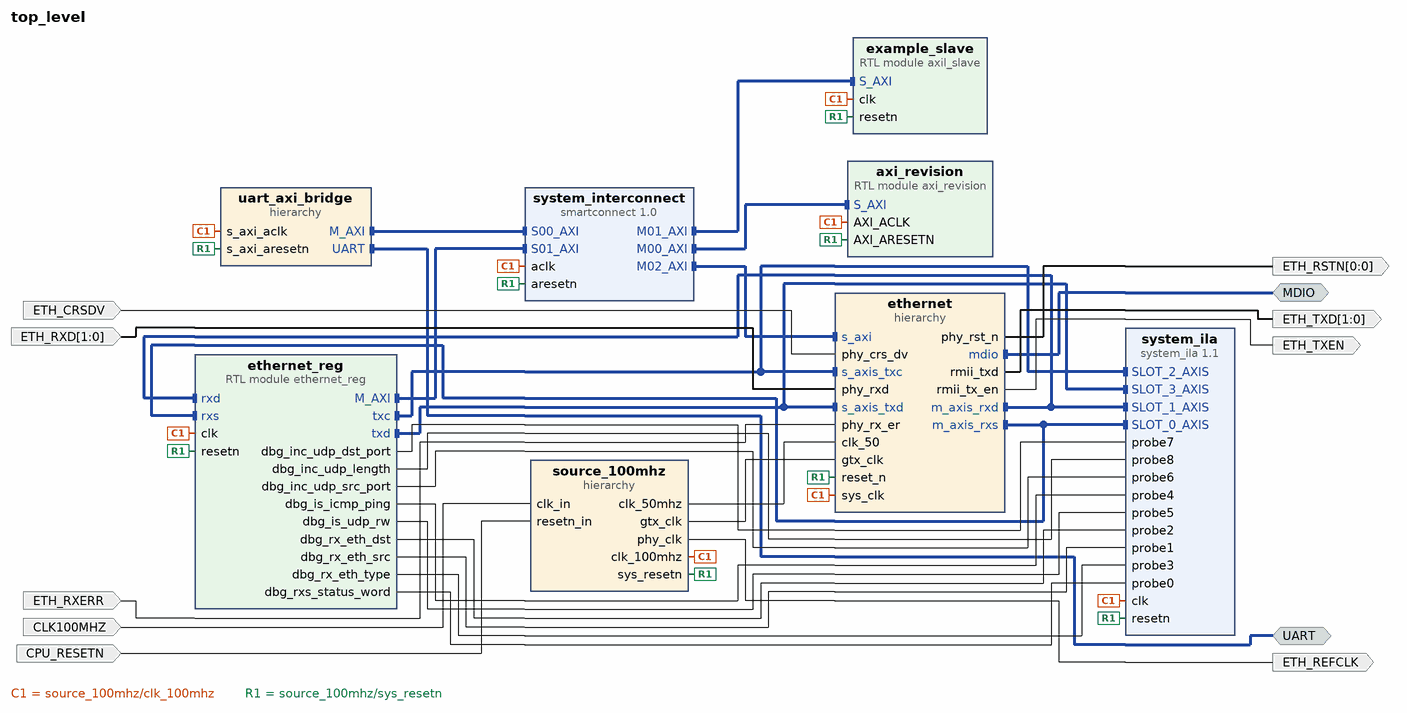
[diagram p0: block diagram of the top level]
# Vivado block design top_level, xc7a100tcsg324-1, Vivado 2024.2
create_bd_design top_level

create_bd_intf_port -mode Master -vlnv xilinx.com:interface:uart_rtl:1.0 UART
create_bd_intf_port -mode Master -vlnv xilinx.com:interface:mdio_rtl:1.0 MDIO
create_bd_port -dir I -type clk CLK100MHZ
create_bd_port -dir I -type rst CPU_RESETN
create_bd_port -dir I ETH_CRSDV
create_bd_port -dir O -from 1 -to 0 ETH_TXD
create_bd_port -dir O ETH_TXEN
create_bd_port -dir I -from 1 -to 0 ETH_RXD
create_bd_port -dir I ETH_RXERR
create_bd_port -dir O -from 0 -to 0 ETH_RSTN
create_bd_port -dir O -type clk ETH_REFCLK

create_bd_cell -type hier source_100mhz
create_bd_cell -type hier uart_axi_bridge
create_bd_cell -type ip -vlnv xilinx.com:ip:smartconnect:1.0 system_interconnect
set_property -dict {CONFIG.NUM_MI 3 CONFIG.NUM_SI 2} [get_bd_cells system_interconnect]
create_bd_cell -type module -reference axi_revision axi_revision
create_bd_cell -type module -reference axil_slave example_slave
create_bd_cell -type hier ethernet
create_bd_cell -type ip -vlnv xilinx.com:ip:system_ila:1.1 system_ila
set_property -dict [list \
  CONFIG.C_MON_TYPE MIX \
  CONFIG.C_NUM_MONITOR_SLOTS 4 \
  CONFIG.C_NUM_OF_PROBES 16 \
  CONFIG.C_SLOT 3 \
  CONFIG.C_SLOT_0_INTF_TYPE xilinx.com:interface:axis_rtl:1.0 \
  CONFIG.C_SLOT_1_INTF_TYPE xilinx.com:interface:axis_rtl:1.0 \
  CONFIG.C_SLOT_2_INTF_TYPE xilinx.com:interface:axis_rtl:1.0 \
  CONFIG.C_SLOT_3_INTF_TYPE xilinx.com:interface:axis_rtl:1.0 \
] [get_bd_cells system_ila]
create_bd_cell -type module -reference ethernet_reg ethernet_reg

# ---- hierarchy /source_100mhz ----
current_bd_instance /source_100mhz
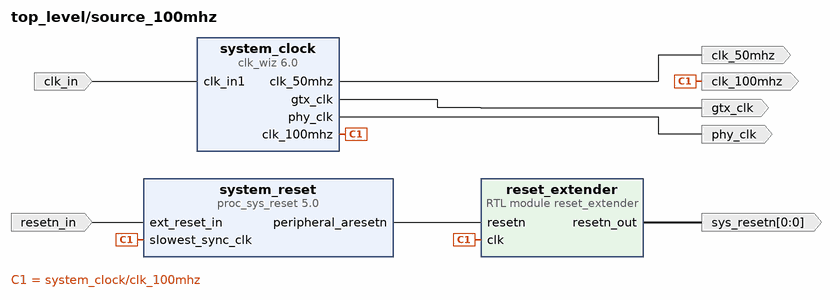
[diagram p1: block diagram inside /source_100mhz]
create_bd_pin -dir I -type clk clk_in
create_bd_pin -dir I -type rst resetn_in
create_bd_pin -dir O -type clk clk_100mhz
create_bd_pin -dir O -from 0 -to 0 sys_resetn
create_bd_pin -dir O clk_50mhz
create_bd_pin -dir O -type clk phy_clk
create_bd_pin -dir O gtx_clk

create_bd_cell -type ip -vlnv xilinx.com:ip:clk_wiz:6.0 system_clock
set_property -dict [list \
  CONFIG.CLKOUT2_JITTER 151.636 \
  CONFIG.CLKOUT2_PHASE_ERROR 98.575 \
  CONFIG.CLKOUT2_REQUESTED_OUT_FREQ 50 \
  CONFIG.CLKOUT2_USED true \
  CONFIG.CLKOUT3_JITTER 151.636 \
  CONFIG.CLKOUT3_PHASE_ERROR 98.575 \
  CONFIG.CLKOUT3_REQUESTED_OUT_FREQ 50 \
  CONFIG.CLKOUT3_REQUESTED_PHASE 45 \
  CONFIG.CLKOUT3_USED true \
  CONFIG.CLKOUT4_JITTER 125.247 \
  CONFIG.CLKOUT4_PHASE_ERROR 98.575 \
  CONFIG.CLKOUT4_REQUESTED_OUT_FREQ 125 \
  CONFIG.CLKOUT4_USED true \
  CONFIG.CLK_OUT1_PORT clk_100mhz \
  CONFIG.CLK_OUT2_PORT clk_50mhz \
  CONFIG.CLK_OUT3_PORT phy_clk \
  CONFIG.CLK_OUT4_PORT gtx_clk \
  CONFIG.MMCM_CLKOUT1_DIVIDE 20 \
  CONFIG.MMCM_CLKOUT2_DIVIDE 20 \
  CONFIG.MMCM_CLKOUT2_PHASE 45.000 \
  CONFIG.MMCM_CLKOUT3_DIVIDE 8 \
  CONFIG.NUM_OUT_CLKS 4 \
  CONFIG.USE_LOCKED false \
  CONFIG.USE_RESET false \
] [get_bd_cells system_clock]
create_bd_cell -type ip -vlnv xilinx.com:ip:proc_sys_reset:5.0 system_reset
create_bd_cell -type module -reference reset_extender reset_extender

# ---- hierarchy /uart_axi_bridge ----
current_bd_instance /uart_axi_bridge
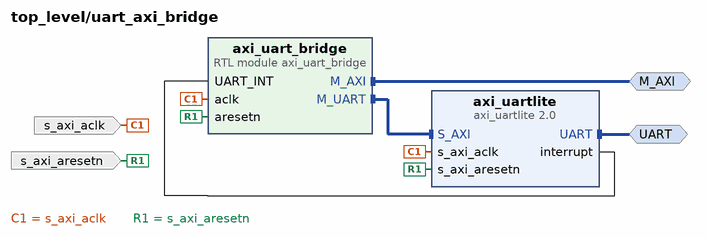
[diagram p2: block diagram inside /uart_axi_bridge]
create_bd_intf_pin -mode Master -vlnv xilinx.com:interface:uart_rtl:1.0 UART
create_bd_intf_pin -mode Master -vlnv xilinx.com:interface:aximm_rtl:1.0 M_AXI
create_bd_pin -dir I -type clk s_axi_aclk
create_bd_pin -dir I -type rst s_axi_aresetn

create_bd_cell -type module -reference axi_uart_bridge axi_uart_bridge
create_bd_cell -type ip -vlnv xilinx.com:ip:axi_uartlite:2.0 axi_uartlite
set_property -dict {CONFIG.C_BAUDRATE 115200} [get_bd_cells axi_uartlite]

# ---- hierarchy /ethernet ----
current_bd_instance /ethernet
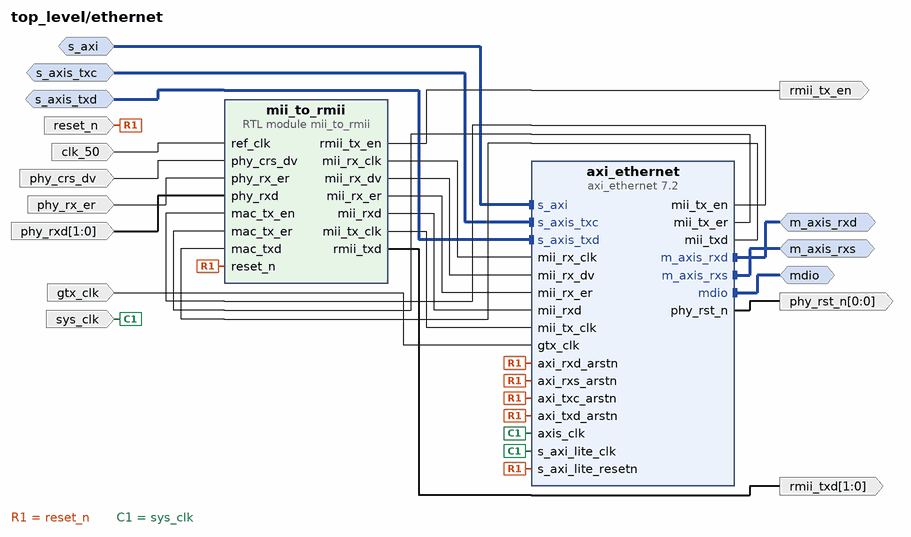
[diagram p3: block diagram inside /ethernet]
create_bd_intf_pin -mode Master -vlnv xilinx.com:interface:axis_rtl:1.0 m_axis_rxd
create_bd_intf_pin -mode Master -vlnv xilinx.com:interface:axis_rtl:1.0 m_axis_rxs
create_bd_intf_pin -mode Master -vlnv xilinx.com:interface:mdio_rtl:1.0 mdio
create_bd_intf_pin -mode Slave -vlnv xilinx.com:interface:aximm_rtl:1.0 s_axi
create_bd_intf_pin -mode Slave -vlnv xilinx.com:interface:axis_rtl:1.0 s_axis_txd
create_bd_intf_pin -mode Slave -vlnv xilinx.com:interface:axis_rtl:1.0 s_axis_txc
create_bd_pin -dir I phy_crs_dv
create_bd_pin -dir I -from 1 -to 0 phy_rxd
create_bd_pin -dir I phy_rx_er
create_bd_pin -dir O -from 1 -to 0 rmii_txd
create_bd_pin -dir O rmii_tx_en
create_bd_pin -dir I clk_50
create_bd_pin -dir I reset_n
create_bd_pin -dir I sys_clk
create_bd_pin -dir O -from 0 -to 0 phy_rst_n
create_bd_pin -dir I gtx_clk

create_bd_cell -type ip -vlnv xilinx.com:ip:axi_ethernet:7.2 axi_ethernet
set_property -dict {CONFIG.Frame_Filter false CONFIG.PHY_TYPE MII CONFIG.Statistics_Counters false} [get_bd_cells axi_ethernet]
create_bd_cell -type module -reference mii_to_rmii mii_to_rmii

# ---- connections ----

current_bd_instance /source_100mhz
connect_bd_net -net clk_in1_0_1 [get_bd_pins clk_in] [get_bd_pins system_clock/clk_in1]
connect_bd_net -net ext_reset_in_0_1 [get_bd_pins resetn_in] [get_bd_pins system_reset/ext_reset_in]
connect_bd_net [get_bd_pins reset_extender/resetn_out] [get_bd_pins sys_resetn]
connect_bd_net [get_bd_pins system_clock/clk_100mhz] \
  [get_bd_pins clk_100mhz] [get_bd_pins system_reset/slowest_sync_clk] [get_bd_pins reset_extender/clk]
connect_bd_net [get_bd_pins system_clock/clk_50mhz] [get_bd_pins clk_50mhz]
connect_bd_net [get_bd_pins system_clock/gtx_clk] [get_bd_pins gtx_clk]
connect_bd_net [get_bd_pins system_clock/phy_clk] [get_bd_pins phy_clk]
connect_bd_net [get_bd_pins system_reset/peripheral_aresetn] [get_bd_pins reset_extender/resetn]

current_bd_instance /uart_axi_bridge
connect_bd_intf_net [get_bd_intf_pins M_AXI] [get_bd_intf_pins axi_uart_bridge/M_AXI]
connect_bd_intf_net [get_bd_intf_pins axi_uart_bridge/M_UART] [get_bd_intf_pins axi_uartlite/S_AXI]
connect_bd_intf_net [get_bd_intf_pins UART] [get_bd_intf_pins axi_uartlite/UART]
connect_bd_net [get_bd_pins axi_uartlite/interrupt] [get_bd_pins axi_uart_bridge/UART_INT]
connect_bd_net -net source_100mhz_sys_clk [get_bd_pins s_axi_aclk] [get_bd_pins axi_uart_bridge/aclk] [get_bd_pins axi_uartlite/s_axi_aclk]
connect_bd_net -net source_100mhz_sys_resetn [get_bd_pins s_axi_aresetn] \
  [get_bd_pins axi_uart_bridge/aresetn] [get_bd_pins axi_uartlite/s_axi_aresetn]

current_bd_instance /ethernet
connect_bd_intf_net [get_bd_intf_pins m_axis_rxd] [get_bd_intf_pins axi_ethernet/m_axis_rxd]
connect_bd_intf_net [get_bd_intf_pins m_axis_rxs] [get_bd_intf_pins axi_ethernet/m_axis_rxs]
connect_bd_intf_net [get_bd_intf_pins mdio] [get_bd_intf_pins axi_ethernet/mdio]
connect_bd_intf_net [get_bd_intf_pins s_axi] [get_bd_intf_pins axi_ethernet/s_axi]
connect_bd_intf_net [get_bd_intf_pins s_axis_txc] [get_bd_intf_pins axi_ethernet/s_axis_txc]
connect_bd_intf_net [get_bd_intf_pins s_axis_txd] [get_bd_intf_pins axi_ethernet/s_axis_txd]
connect_bd_net [get_bd_pins axi_ethernet/mii_tx_en] [get_bd_pins mii_to_rmii/mac_tx_en]
connect_bd_net [get_bd_pins axi_ethernet/mii_tx_er] [get_bd_pins mii_to_rmii/mac_tx_er]
connect_bd_net [get_bd_pins axi_ethernet/mii_txd] [get_bd_pins mii_to_rmii/mac_txd]
connect_bd_net [get_bd_pins axi_ethernet/phy_rst_n] [get_bd_pins phy_rst_n]
connect_bd_net -net clk50_1 [get_bd_pins clk_50] [get_bd_pins mii_to_rmii/ref_clk]
connect_bd_net [get_bd_pins gtx_clk] [get_bd_pins axi_ethernet/gtx_clk]
connect_bd_net [get_bd_pins mii_to_rmii/mii_rx_clk] [get_bd_pins axi_ethernet/mii_rx_clk]
connect_bd_net [get_bd_pins mii_to_rmii/mii_rx_dv] [get_bd_pins axi_ethernet/mii_rx_dv]
connect_bd_net [get_bd_pins mii_to_rmii/mii_rx_er] [get_bd_pins axi_ethernet/mii_rx_er]
connect_bd_net [get_bd_pins mii_to_rmii/mii_rxd] [get_bd_pins axi_ethernet/mii_rxd]
connect_bd_net [get_bd_pins mii_to_rmii/mii_tx_clk] [get_bd_pins axi_ethernet/mii_tx_clk]
connect_bd_net [get_bd_pins mii_to_rmii/rmii_tx_en] [get_bd_pins rmii_tx_en]
connect_bd_net [get_bd_pins mii_to_rmii/rmii_txd] [get_bd_pins rmii_txd]
connect_bd_net -net phy_crs_dv_0_1 [get_bd_pins phy_crs_dv] [get_bd_pins mii_to_rmii/phy_crs_dv]
connect_bd_net -net phy_rx_er_0_1 [get_bd_pins phy_rx_er] [get_bd_pins mii_to_rmii/phy_rx_er]
connect_bd_net -net phy_rxd_0_1 [get_bd_pins phy_rxd] [get_bd_pins mii_to_rmii/phy_rxd]
connect_bd_net [get_bd_pins reset_n] \
  [get_bd_pins mii_to_rmii/reset_n] [get_bd_pins axi_ethernet/axi_txc_arstn] [get_bd_pins axi_ethernet/axi_txd_arstn] \
  [get_bd_pins axi_ethernet/s_axi_lite_resetn] [get_bd_pins axi_ethernet/axi_rxd_arstn] \
  [get_bd_pins axi_ethernet/axi_rxs_arstn]
connect_bd_net [get_bd_pins sys_clk] [get_bd_pins axi_ethernet/axis_clk] [get_bd_pins axi_ethernet/s_axi_lite_clk]

current_bd_instance /
connect_bd_intf_net -intf_net axi_uartlite_UART [get_bd_intf_ports UART] [get_bd_intf_pins uart_axi_bridge/UART]
connect_bd_intf_net [get_bd_intf_pins ethernet_reg/rxd] [get_bd_intf_pins ethernet/m_axis_rxd]
connect_bd_intf_net [get_bd_intf_pins ethernet_reg/rxd] [get_bd_intf_pins system_ila/SLOT_1_AXIS]
connect_bd_intf_net [get_bd_intf_pins ethernet_reg/rxs] [get_bd_intf_pins ethernet/m_axis_rxs]
connect_bd_intf_net [get_bd_intf_pins ethernet_reg/rxs] [get_bd_intf_pins system_ila/SLOT_0_AXIS]
connect_bd_intf_net [get_bd_intf_ports MDIO] [get_bd_intf_pins ethernet/mdio]
connect_bd_intf_net [get_bd_intf_pins ethernet_reg/M_AXI] [get_bd_intf_pins system_interconnect/S01_AXI]
connect_bd_intf_net [get_bd_intf_pins ethernet/s_axis_txc] [get_bd_intf_pins ethernet_reg/txc]
connect_bd_intf_net [get_bd_intf_pins ethernet/s_axis_txc] [get_bd_intf_pins system_ila/SLOT_2_AXIS]
connect_bd_intf_net [get_bd_intf_pins ethernet/s_axis_txd] [get_bd_intf_pins ethernet_reg/txd]
connect_bd_intf_net [get_bd_intf_pins ethernet/s_axis_txd] [get_bd_intf_pins system_ila/SLOT_3_AXIS]
connect_bd_intf_net [get_bd_intf_pins system_interconnect/M00_AXI] [get_bd_intf_pins axi_revision/S_AXI]
connect_bd_intf_net [get_bd_intf_pins example_slave/S_AXI] [get_bd_intf_pins system_interconnect/M01_AXI]
connect_bd_intf_net [get_bd_intf_pins system_interconnect/M02_AXI] [get_bd_intf_pins ethernet/s_axi]
connect_bd_intf_net [get_bd_intf_pins uart_axi_bridge/M_AXI] [get_bd_intf_pins system_interconnect/S00_AXI]
connect_bd_net [get_bd_ports ETH_CRSDV] [get_bd_pins ethernet/phy_crs_dv]
connect_bd_net [get_bd_ports ETH_RXD] [get_bd_pins ethernet/phy_rxd]
connect_bd_net [get_bd_ports ETH_RXERR] [get_bd_pins ethernet/phy_rx_er]
connect_bd_net -net clk_in1_0_1 [get_bd_ports CLK100MHZ] [get_bd_pins source_100mhz/clk_in]
connect_bd_net [get_bd_pins ethernet/phy_rst_n] [get_bd_ports ETH_RSTN]
connect_bd_net [get_bd_pins ethernet_reg/dbg_inc_udp_dst_port] [get_bd_pins system_ila/probe7]
connect_bd_net [get_bd_pins ethernet_reg/dbg_inc_udp_length] [get_bd_pins system_ila/probe8]
connect_bd_net [get_bd_pins ethernet_reg/dbg_inc_udp_src_port] [get_bd_pins system_ila/probe6]
connect_bd_net [get_bd_pins ethernet_reg/dbg_is_icmp_ping] [get_bd_pins system_ila/probe4]
connect_bd_net [get_bd_pins ethernet_reg/dbg_is_udp_rw] [get_bd_pins system_ila/probe5]
connect_bd_net [get_bd_pins ethernet_reg/dbg_rx_eth_dst] [get_bd_pins system_ila/probe2]
connect_bd_net [get_bd_pins ethernet_reg/dbg_rx_eth_src] [get_bd_pins system_ila/probe1]
connect_bd_net [get_bd_pins ethernet_reg/dbg_rx_eth_type] [get_bd_pins system_ila/probe3]
connect_bd_net [get_bd_pins ethernet_reg/dbg_rxs_status_word] [get_bd_pins system_ila/probe0]
connect_bd_net [get_bd_pins ethernet/rmii_tx_en] [get_bd_ports ETH_TXEN]
connect_bd_net [get_bd_pins ethernet/rmii_txd] [get_bd_ports ETH_TXD]
connect_bd_net -net ext_reset_in_0_1 [get_bd_ports CPU_RESETN] [get_bd_pins source_100mhz/resetn_in]
connect_bd_net [get_bd_pins source_100mhz/clk_50mhz] [get_bd_pins ethernet/clk_50]
connect_bd_net [get_bd_pins source_100mhz/gtx_clk] [get_bd_pins ethernet/gtx_clk]
connect_bd_net [get_bd_pins source_100mhz/phy_clk] [get_bd_ports ETH_REFCLK]
connect_bd_net -net source_100mhz_sys_clk [get_bd_pins source_100mhz/clk_100mhz] \
  [get_bd_pins uart_axi_bridge/s_axi_aclk] [get_bd_pins system_interconnect/aclk] [get_bd_pins axi_revision/AXI_ACLK] \
  [get_bd_pins ethernet/sys_clk] [get_bd_pins system_ila/clk] [get_bd_pins ethernet_reg/clk] [get_bd_pins example_slave/clk]
connect_bd_net [get_bd_pins source_100mhz/sys_resetn] \
  [get_bd_pins uart_axi_bridge/s_axi_aresetn] [get_bd_pins system_interconnect/aresetn] \
  [get_bd_pins axi_revision/AXI_ARESETN] [get_bd_pins ethernet/reset_n] [get_bd_pins system_ila/resetn] \
  [get_bd_pins ethernet_reg/resetn] [get_bd_pins example_slave/resetn]

# ---- address map ----
assign_bd_address -offset 0x00000000 -range 256 -target_address_space [get_bd_addr_spaces ethernet_reg/M_AXI] [get_bd_addr_segs axi_revision/S_AXI/reg0]
assign_bd_address -offset 0x00001000 -range 256 -target_address_space [get_bd_addr_spaces ethernet_reg/M_AXI] [get_bd_addr_segs example_slave/S_AXI/reg0]
assign_bd_address -offset 0x00004000 -range 4K -target_address_space [get_bd_addr_spaces ethernet_reg/M_AXI] [get_bd_addr_segs ethernet/axi_ethernet/s_axi/Reg0]
assign_bd_address -offset 0x0000000000000000 -range 256 -target_address_space [get_bd_addr_spaces uart_axi_bridge/axi_uart_bridge/M_AXI] [get_bd_addr_segs axi_revision/S_AXI/reg0]
assign_bd_address -offset 0x0000000000001000 -range 256 -target_address_space [get_bd_addr_spaces uart_axi_bridge/axi_uart_bridge/M_AXI] [get_bd_addr_segs example_slave/S_AXI/reg0]
assign_bd_address -offset 0x0000000000004000 -range 4K -target_address_space [get_bd_addr_spaces uart_axi_bridge/axi_uart_bridge/M_AXI] [get_bd_addr_segs ethernet/axi_ethernet/s_axi/Reg0]
assign_bd_address -offset 0x40600000 -range 64K -target_address_space [get_bd_addr_spaces uart_axi_bridge/axi_uart_bridge/M_UART] [get_bd_addr_segs uart_axi_bridge/axi_uartlite/S_AXI/Reg]

validate_bd_design
save_bd_design
